# Altium schematic sheet MPU6050.SchDoc
size A
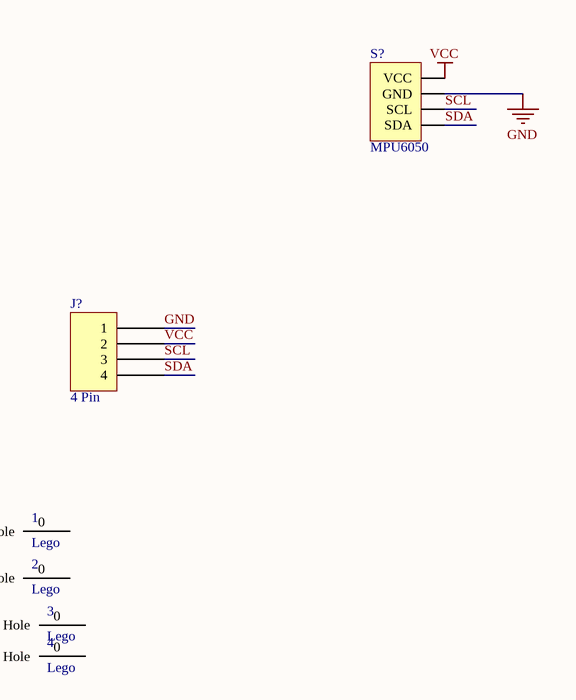
[diagram p0: MPU6050.SchDoc]

## Parts
1  Lego  [Lego Hole]
2  Lego  [Lego Hole]
3  Lego  [Lego Hole]
4  Lego  [Lego Hole]
J?  4 Pin  [JST XH B4B-XH-A - RIGHT]
S?  MPU6050  [MPU6050]

## Nets
GND: J?.1 S?.2(GND)
VCC: J?.2 S?.1(VCC)
SCL: J?.3 S?.3(SCL)
SDA: J?.4 S?.4(SDA)

Not connected (* = marked no-connect by the designer): 1 0(Lego_Hole); 2 0(Lego_Hole); 3 0(Lego_Hole); 4 0(Lego_Hole)